# Altium schematic sheet MAX5875_1.SchDoc
size A; SheetNumber: 14; SheetTotal: 24
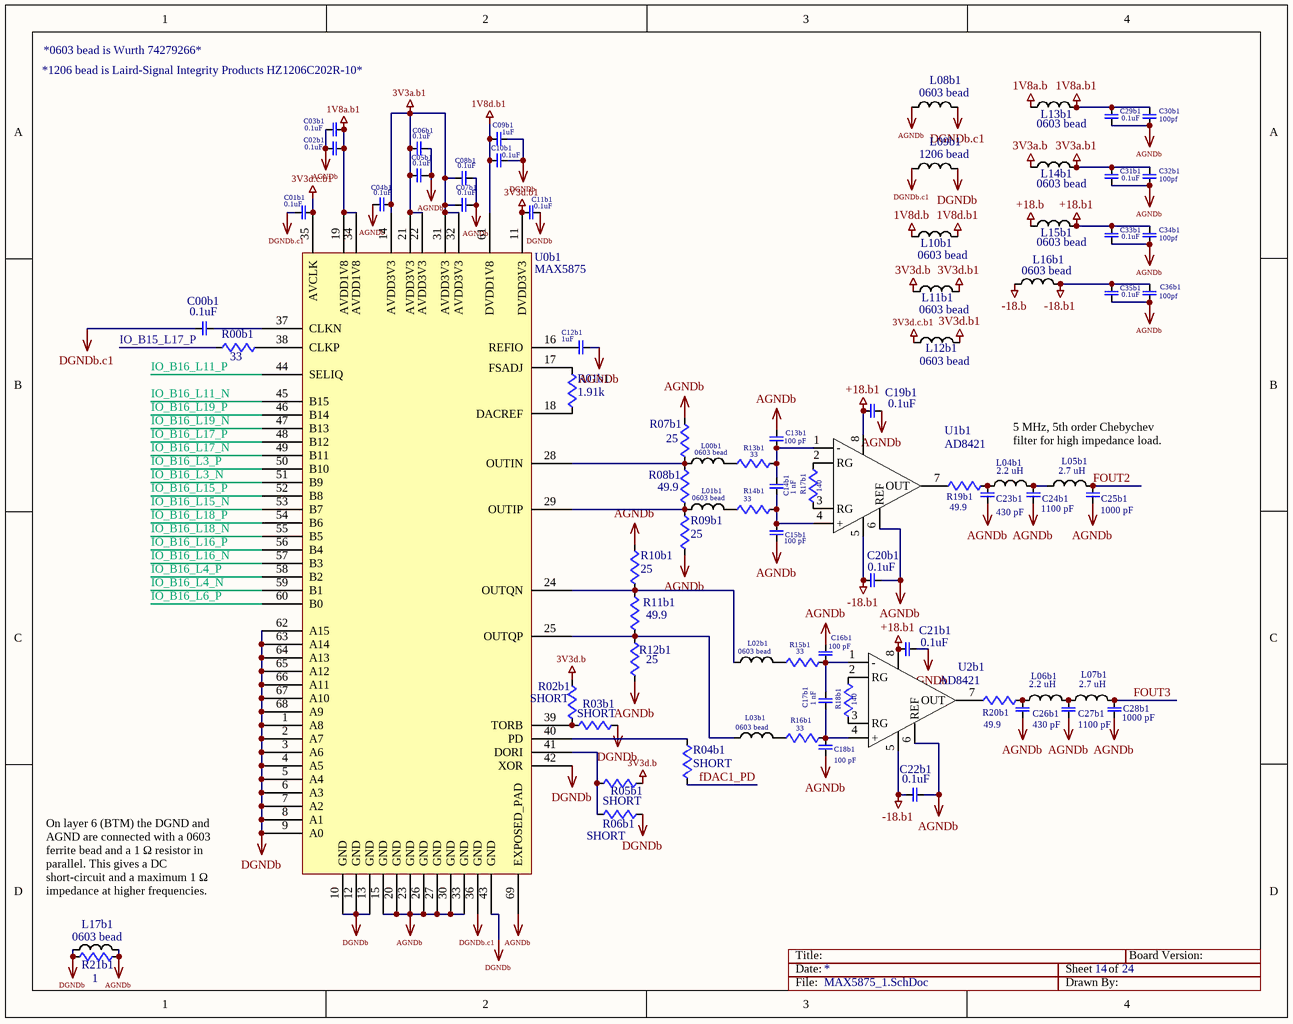
[diagram p0: MAX5875_1.SchDoc]

## Parts
C00b1  0.1uF  [0402]
C01b1  0.1uF  [0402]
C02b1  0.1uF  [0402]
C03b1  0.1uF  [0402]
C04b1  0.1uF  [0402]
C05b1  0.1uF  [0402]
C06b1  0.1uF  [0402]
C07b1  0.1uF  [0402]
C08b1  0.1uF  [0402]
C09b1  1uF  [0603]
C10b1  0.1uF  [0402]
C11b1  0.1uF  [0402]
C12b1  1uF  [0402]
C13b1  100 pF  [0603]
C14b1  1 nF  [0603]
C15b1  100 pF  [0603]
C16b1  100 pF  [0603]
C17b1  1 nF  [0603]
C18b1  100 pF  [0603]
C19b1  0.1uF  [0603]
C20b1  0.1uF  [0603]
C21b1  0.1uF  [0603]
C22b1  0.1uF  [0603]
C23b1  430 pF  [0603]
C24b1  1100 pF  [0603]
C25b1  1000 pF  [0603]
C26b1  430 pF  [0603]
C27b1  1100 pF  [0603]
C28b1  1000 pF  [0603]
C29b1  0.1uF  [0603]
C30b1  100pf  [0603]
C31b1  0.1uF  [0603]
C32b1  100pf  [0603]
C33b1  0.1uF  [0603]
C34b1  100pf  [0603]
C35b1  0.1uF  [0603]
C36b1  100pf  [0603]
L00b1  0603 bead  [0603]
L01b1  0603 bead  [0603]
L02b1  0603 bead  [0603]
L03b1  0603 bead  [0603]
L04b1  2.2 uH  [0603]
L05b1  2.7 uH  [0603]
L06b1  2.2 uH  [0603]
L07b1  2.7 uH  [0603]
L08b1  0603 bead  [0603]
L09b1  1206 bead  [1206]
L10b1  0603 bead  [0603]
L11b1  0603 bead  [0603]
L12b1  0603 bead  [0603]
L13b1  0603 bead  [0603]
L14b1  0603 bead  [0603]
L15b1  0603 bead  [0603]
L16b1  0603 bead  [0603]
L17b1  0603 bead  [0603]
R00b1  33  [0402]
R01b1  1.91k  [0603]
R02b1  SHORT  [0603]
R03b1  SHORT  [0603]
R04b1  SHORT  [0603]
R05b1  SHORT  [0603]
R06b1  SHORT  [0603]
R07b1  25  [0603]
R08b1  49.9  [0603]
R09b1  25  [0603]
R10b1  25  [0603]
R11b1  49.9  [0603]
R12b1  25  [0603]
R13b1  33  [0603]
R14b1  33  [0603]
R15b1  33  [0603]
R16b1  33  [0603]
R17b1  140  [0402]
R18b1  140  [0402]
R19b1  49.9  [0603]
R20b1  49.9  [0603]
R21b1  1  [0603]
U0b1  MAX5875  [68LQFN]
U1b1  AD8421  [8SOIC]
U2b1  AD8421  [8SOIC]

## Nets
1V8a.b: L13b1.1
1V8a.b1: C02b1.1 C03b1.2 C29b1.1 C30b1.1 L13b1.2 U0b1.19(AVDD1V8) U0b1.34(AVDD1V8)
1V8d.b: L10b1.1
1V8d.b1: C09b1.2 C10b1.2 L10b1.2 U0b1.61(DVDD1V8)
3V3a.b: L14b1.1
3V3a.b1: C04b1.1 C05b1.2 C06b1.1 C07b1.2 C08b1.1 C31b1.1 C32b1.1 L14b1.2 U0b1.14(AVDD3V3) U0b1.21(AVDD3V3) U0b1.22(AVDD3V3) U0b1.31(AVDD3V3) U0b1.32(AVDD3V3)
3V3d.b: L11b1.1 R02b1.2 R05b1.2
3V3d.b1: C11b1.2 L11b1.2 L12b1.2 U0b1.11(DVDD3V3)
3V3d.c.b1: C01b1.1 L12b1.1 U0b1.35(AVCLK)
+18.b: L15b1.1
+18.b1: C19b1.2 C21b1.2 C33b1.1 C34b1.1 L15b1.2 U1b1.8(+VS) U2b1.8(+VS)
-18.b: L16b1.1
-18.b1: C20b1.2 C22b1.2 C35b1.1 C36b1.1 L16b1.2 U1b1.5(-VS) U2b1.5(-VS)
AGNDb: C02b1.2 C03b1.1 C04b1.2 C05b1.1 C06b1.2 C07b1.1 C08b1.2 C12b1.1 C13b1.1 C15b1.1 C16b1.1 C18b1.1 C19b1.1 C20b1.1 C21b1.1 C22b1.1 C23b1.2 C24b1.2 C25b1.2 C26b1.2 C27b1.2 C28b1.2 C29b1.2 C30b1.2 C31b1.2 C32b1.2 C33b1.2 C34b1.2 C35b1.2 C36b1.2 L08b1.1 L17b1.2 R07b1.2 R09b1.1 R10b1.2 R12b1.1 R21b1.1 U0b1.15(GND) U0b1.20(GND) U0b1.23(GND) U0b1.26(GND) U0b1.27(GND) U0b1.30(GND) U0b1.33(GND) U0b1.69(EXPOSED_PAD) U1b1.6(REF) U2b1.6(REF)
DGNDb: C09b1.1 C10b1.1 C11b1.1 L09b1.2 L17b1.1 R03b1.2 R06b1.2 R21b1.2 U0b1.1(A8) U0b1.2(A7) U0b1.3(A6) U0b1.4(A5) U0b1.5(A4) U0b1.6(A3) U0b1.7(A2) U0b1.8(A1) U0b1.9(A0) U0b1.10(GND) U0b1.12(GND) U0b1.13(GND) U0b1.42(XOR) U0b1.43(GND) U0b1.62(A15) U0b1.63(A14) U0b1.64(A13) U0b1.65(A12) U0b1.66(A11) U0b1.67(A10) U0b1.68(A9)
DGNDb.c1: C00b1.2 C01b1.2 L08b1.2 L09b1.1 U0b1.36(GND)
fDAC1_PD: R04b1.2
FOUT2: C25b1.1 L05b1.2
FOUT3: C28b1.1 L07b1.2
IO_B15_L17_P: R00b1.2
IO_B16_L3_N: U0b1.51(B9)
IO_B16_L3_P: U0b1.50(B10)
IO_B16_L4_N: U0b1.59(B1)
IO_B16_L4_P: U0b1.58(B2)
IO_B16_L6_P: U0b1.60(B0)
IO_B16_L11_N: U0b1.45(B15)
IO_B16_L11_P: U0b1.44(SELIQ)
IO_B16_L15_N: U0b1.53(B7)
IO_B16_L15_P: U0b1.52(B8)
IO_B16_L16_N: U0b1.57(B3)
IO_B16_L16_P: U0b1.56(B4)
IO_B16_L17_N: U0b1.49(B11)
IO_B16_L17_P: U0b1.48(B12)
IO_B16_L18_N: U0b1.55(B5)
IO_B16_L18_P: U0b1.54(B6)
IO_B16_L19_N: U0b1.47(B13)
IO_B16_L19_P: U0b1.46(B14)
NetC00b1_1: C00b1.1 U0b1.37(CLKN)
NetC12b1_2: C12b1.2 U0b1.16(REFIO)
NetC13b1_2: C13b1.2 C14b1.1 R13b1.1 U1b1.1(-)
NetC14b1_2: C14b1.2 C15b1.2 R14b1.1 U1b1.4(+)
NetC16b1_2: C16b1.2 C17b1.1 R15b1.1 U2b1.1(-)
NetC17b1_2: C17b1.2 C18b1.2 R16b1.1 U2b1.4(+)
NetC23b1_1: C23b1.1 L04b1.1 R19b1.2
NetC24b1_1: C24b1.1 L04b1.2 L05b1.1
NetC26b1_1: C26b1.1 L06b1.1 R20b1.2
NetC27b1_1: C27b1.1 L06b1.2 L07b1.1
NetL00b1_1: L00b1.1 R07b1.1 R08b1.2 U0b1.28(OUTIN)
NetL00b1_2: L00b1.2 R13b1.2
NetL01b1_1: L01b1.1 R08b1.1 R09b1.2 U0b1.29(OUTIP)
NetL01b1_2: L01b1.2 R14b1.2
NetL02b1_1: L02b1.1 R10b1.1 R11b1.2 U0b1.24(OUTQN)
NetL02b1_2: L02b1.2 R15b1.2
NetL03b1_1: L03b1.1 R11b1.1 R12b1.2 U0b1.25(OUTQP)
NetL03b1_2: L03b1.2 R16b1.2
NetR00b1_1: R00b1.1 U0b1.38(CLKP)
NetR01b1_1: R01b1.1 U0b1.18(DACREF)
NetR01b1_2: R01b1.2 U0b1.17(FSADJ)
NetR02b1_1: R02b1.1 R03b1.1 U0b1.39(TORB)
NetR04b1_1: R04b1.1 U0b1.40(PD)
NetR05b1_1: R05b1.1 R06b1.1 U0b1.41(DORI)
NetR17b1_1: R17b1.1 U1b1.3(RG)
NetR17b1_2: R17b1.2 U1b1.2(RG)
NetR18b1_1: R18b1.1 U2b1.3(RG)
NetR18b1_2: R18b1.2 U2b1.2(RG)
NetR19b1_1: R19b1.1 U1b1.7(OUT)
NetR20b1_1: R20b1.1 U2b1.7(OUT)

## Notes on the sheet
- *1206 bead is Laird-Signal Integrity Products HZ1206C202R-10*
- *0603 bead is Wurth 74279266*
- 5 MHz, 5th order Chebychev filter for high impedance load.
- On layer 6 (BTM) the DGND and AGND are connected with a 0603 ferrite bead and a 1 Ω resistor in parallel. This gives a DC short-circuit and a maximum 1 Ω impedance at higher frequencies.
- Title:
- Date:
- Sheet
- of
- Board Version:
- File:
- Drawn By:

## Library data of the parts
C00b1 C01b1 C02b1 C03b1 C04b1 C05b1 C06b1 C07b1 C08b1 C09b1 C10b1 C11b1 C12b1 C13b1 C14b1 C15b1 C16b1 C17b1 C18b1 C19b1 C20b1 C21b1 C22b1 C23b1 C24b1 C25b1 C26b1 C27b1 C28b1 C29b1 C30b1 C31b1 C32b1 C33b1 C34b1 C35b1 C36b1 = CAP
L00b1 L01b1 L02b1 L03b1 L04b1 L05b1 L06b1 L07b1 L08b1 L09b1 L10b1 L11b1 L12b1 L13b1 L14b1 L15b1 L16b1 L17b1 = INDUCTOR
R00b1 R01b1 R02b1 R03b1 R04b1 R05b1 R06b1 R07b1 R08b1 R09b1 R10b1 R11b1 R12b1 R13b1 R14b1 R15b1 R16b1 R17b1 R18b1 R19b1 R20b1 R21b1 = RES